# EAGLE design segger_adaptor_v1 (EAGLE 6.5.0)
AUTHOR: Noah Klugman; REV: A; TITLE: JLink to Tag Connect
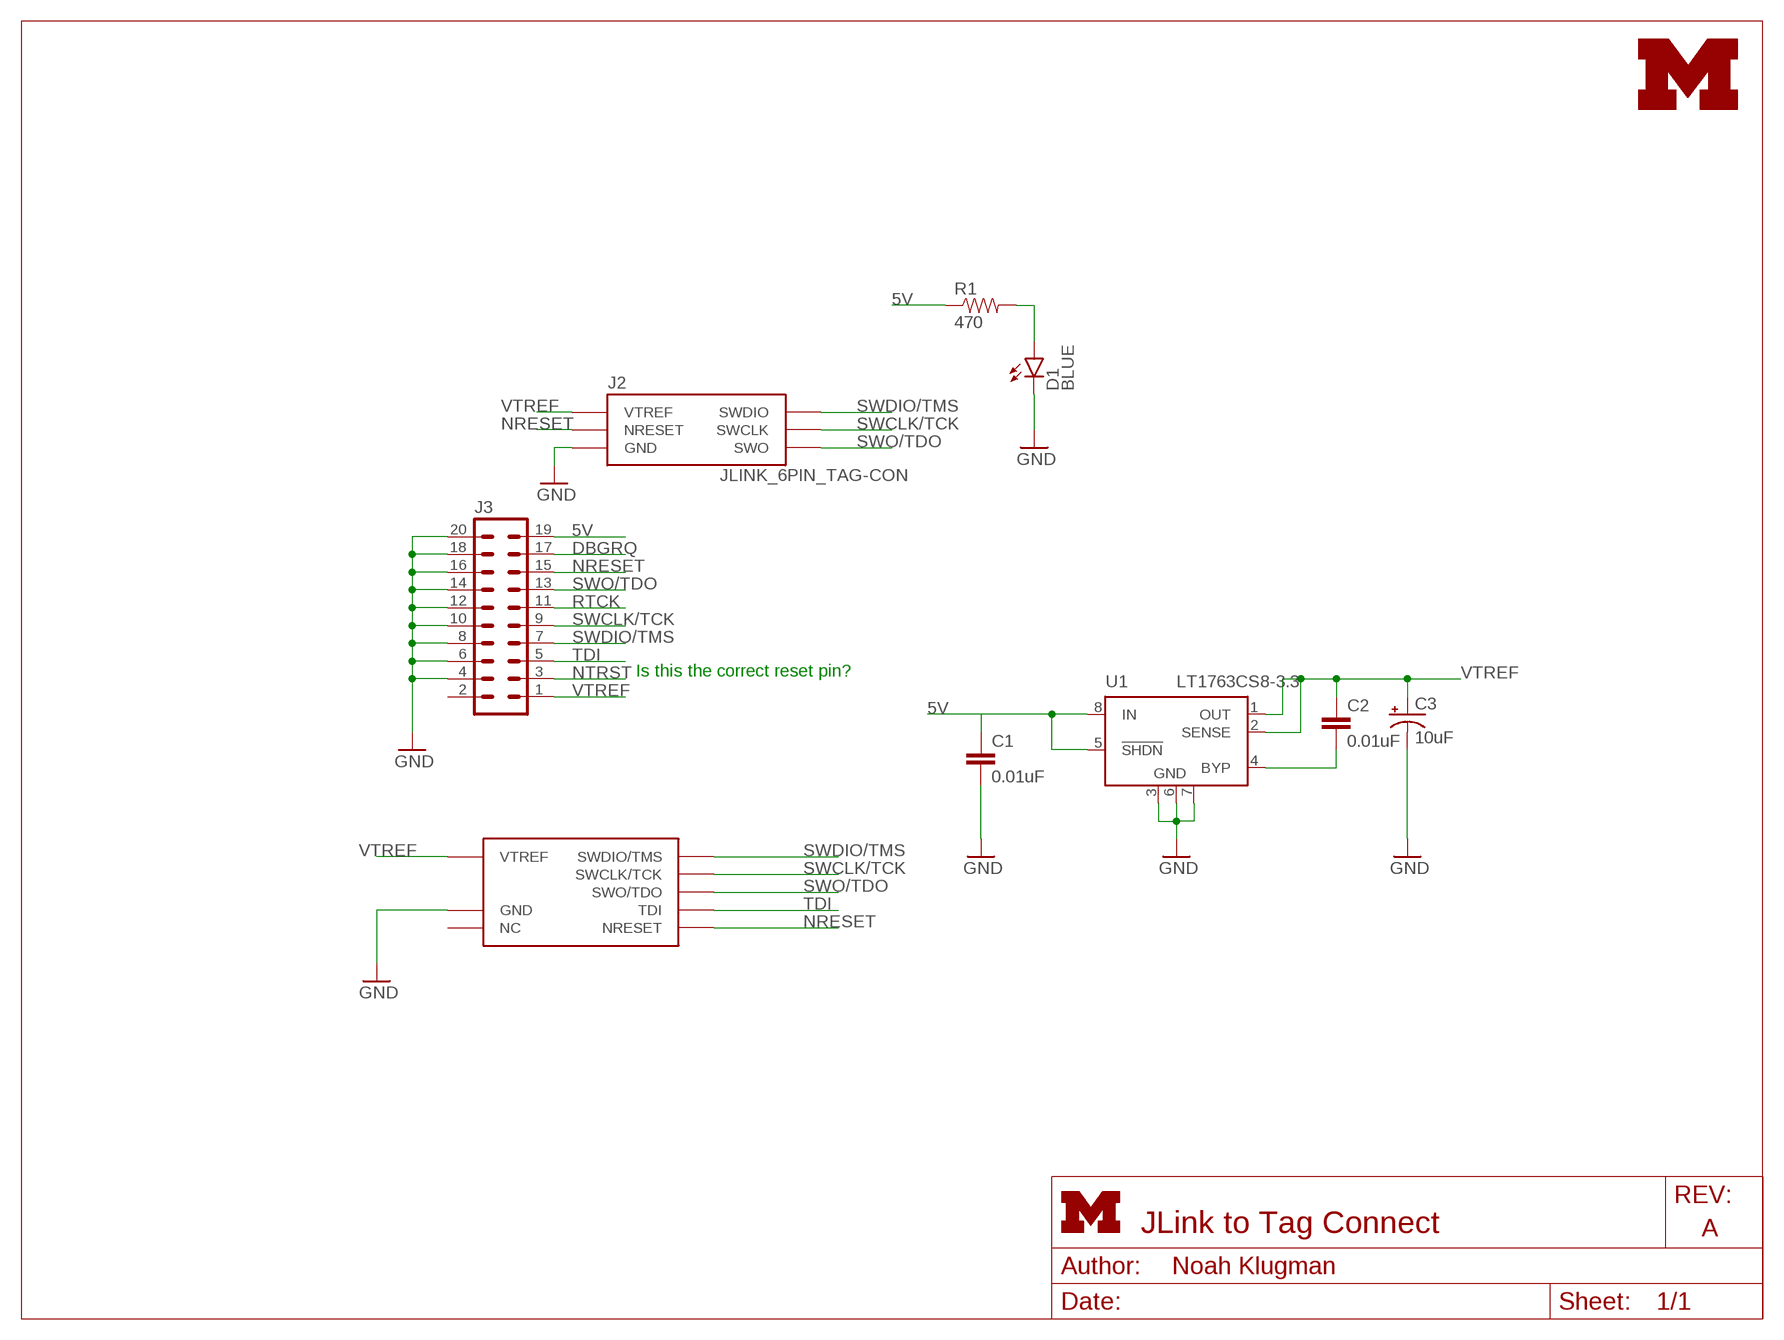
[diagram p0: schematic, sheet 1]
FRAME1 (LETTER_L): HEIGHT: 8.5in; WIDTH: 11in

## Parts
C1  0.01uF  C-EUC0603  [C0603]
C2  0.01uF  C-EUC0603  [C0603]
C3  10uF  CAP_POL1206  [EIA3216]
D1  BLUE  LED-BLUE0603  [LED-0603]
J1  PINHD-2X5/0.050-NO7  [2X5-0.050-NO7]
J2  JLINK_6PIN_TAG-CON  [2X3_MALE_SHROUDED_0.100]
J3  ML20  [ML20]
LOGO1  UMICH_SOLID_SMALL+  [UMICH_SOLID_100MIL]
R1  470  RESISTOR0603-RES  [0603-RES]
U1  LT1763CS8-3.3  [SOIC8]

## Nets
5V: C1.1 J3.19 R1.1 U1.5(!SHDN) U1.8(IN)
DBGRQ: J3.17
GND: C1.2 C3.C(-) D1.C J1.GND@1(GND) J1.GND@2(GND) J2.5(GND) J3.4 J3.6 J3.8 J3.10 J3.12 J3.14 J3.16 J3.18 J3.20 U1.3(GND) U1.6(GND) U1.7(GND)
N$3: D1.A R1.2
N$4: C2.2 U1.4(BYP)
NRESET: J1.NRESET J2.3(NRESET) J3.15
NTRST: J3.3
RTCK: J3.11
SWCLK/TCK: J1.SWCLK/TCK J2.4(SWCLK) J3.9
SWDIO/TMS: J1.SWDIO/TMS J2.2(SWDIO) J3.7
SWO/TDO: J1.SWO/TDO J2.6(SWO) J3.13
TDI: J1.TDI J3.5
VTREF: C2.1 C3.A(+) J1.VTREF J2.1(VTREF) J3.1 U1.1(OUT) U1.2(SENSE)
Unconnected: J1.NC J3.2

## Notes on the sheet
- Is this the correct reset pin?

## Library data of the parts
C1 C2 = resistor:C-EU: CAPACITOR, European symbol; DIGIKEY: 490-1512-1-ND
C3 = SparkFun-Passives:CAP_POL: Capacitor Polarized These are standard SMD and PTH capacitors. Normally 10uF, 47uF, and 100uF in electrolytic and tantalum varieties. Always verify the external diameter of the through hole cap, it varies with capacity, voltage, and manufacturer. The EIA devices should be standard.; DIGIKEY: 399-3684-1-ND
D1 = SparkFun-LED:LED-BLUE: Blue LEDs for production use Various blue LEDs stocked by SparkFun production 0603 - DIO-08575 Rebel - DIO-09553 1206 - DIO-09911; PROD_ID: DIO-08575
J1 = headers:PINHD-2X5/0.050-NO7; DIGIKEY: 609-3712-ND
J2 = headers:JLINK_6PIN_TAG-CON: This is a 6-pin Tag Connect header with the J-Link.; DIGIKEY: 3M15451-ND
J3 = con-ml:ML20: HARTING; DIGIKEY: S9172-ND; OC_FARNELL: unknown; OC_NEWARK: unknown
LOGO1 = logos:UMICH_SOLID
R1 = SparkFun-Passives:RESISTOR: Resistor Basic schematic elements and footprints for 0603, 1206, and PTH resistors.
U1 = linear-technology:LT1763CS8: 500mA, Low Noise, LDO Micropower Regulators Source: http://cds.linear.com/docs/Datasheet/1763ff.pdf; DIGIKEY: LT1763CS8-3.3#TRPBFCT-ND; MPN: LT1763CS8-3.3; OC_FARNELL: 1273617; OC_NEWARK: 57M6055

## Board
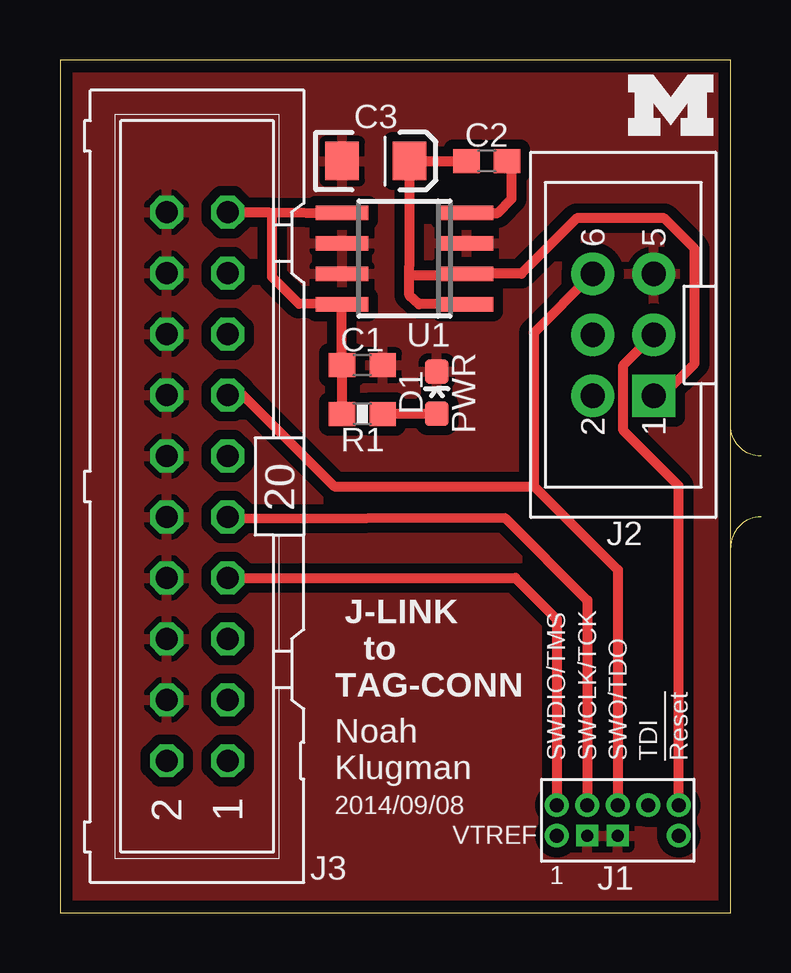
[diagram p1: board, top side]
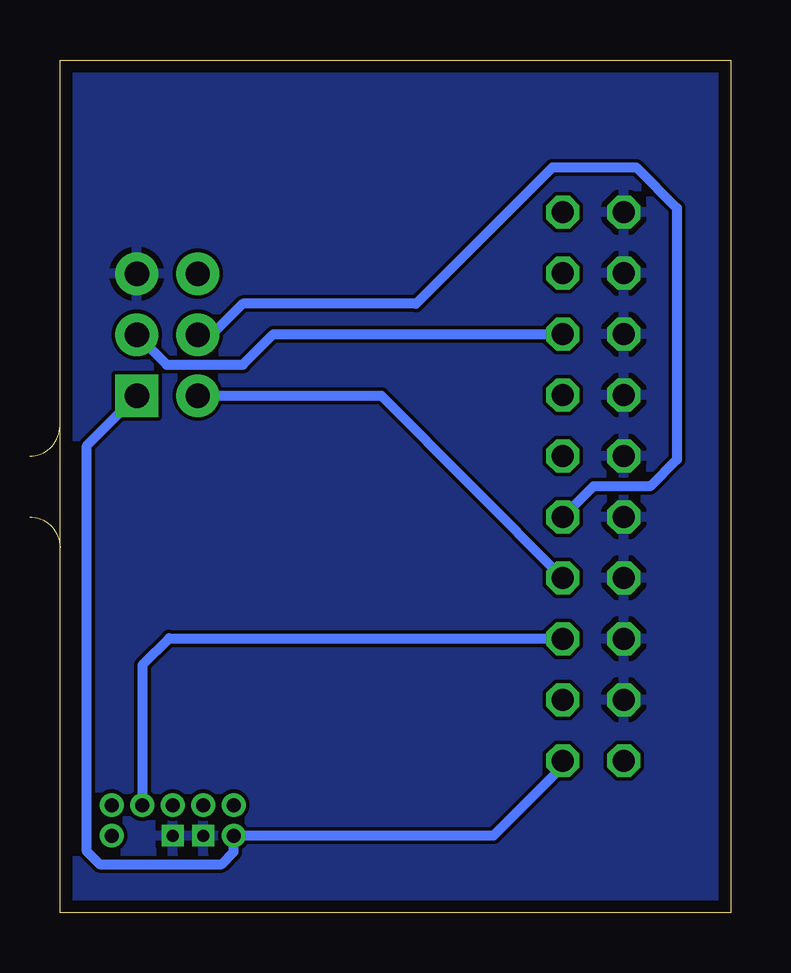
[diagram p2: board, bottom side, seen from below]

Size 27.94 x 35.56 mm. Coordinates in mm from the lower left corner, seen from the top.
Outline: 0,35.56 0,0 27.94,0 27.94,35.56 0,35.56
Copper layers (1*16): Top 0.0178mm / dielectric 59mil / Bottom 0.0178mm
Design rules "sunstone-2lyr_v1.0.0.3": minimum track width 6mil, minimum drill 14mil, track to track 6mil, track to pad 6mil, pad to pad 6mil, via to via 6mil, smd to smd 6mil, copper to edge 20mil, drill to drill 16mil, minimum pad ring 8mil, minimum via ring 8mil, stop-mask expansion 3mil, vias tented up to drill 0mil, thermal gap 10mil
Milling: 7 lines

### Footprints (pad centres in the part's own frame; a part is rotated, then mirrored left to right if it is on the bottom)
C0603 = smd 1.1 x 1: 1 -0.85,0; 2 0.85,0
EIA3216 = smd 1.4 x 1.6: A 1.4,0; C -1.4,0
LED-0603 = smd 1 x 1: A 0,-0.877; C 0,0.877
2X5-0.050-NO7 = drill 0.5 square: GND@1 -2.54,0; GND@2 -1.27,0 | drill 0.584: NC 1.27,0; NRESET 1.27,1.27; SWCLK/TCK -2.54,1.27; SWDIO/TMS -3.81,1.27; SWO/TDO -1.27,1.27; TDI 0,1.27; VTREF -3.81,0
2X3_MALE_SHROUDED_0.100 = drill 1.016 pad 1.778 square: 1 -2.54,-1.27 | drill 1.016 pad 1.778: 2 -2.54,1.27; 3 0,-1.27; 4 0,1.27; 5 2.54,-1.27; 6 2.54,1.27
ML20 = drill 0.914 octagon: 1 -11.43,-1.27; 2 -11.43,1.27; 3 -8.89,-1.27; 4 -8.89,1.27; 5 -6.35,-1.27; 6 -6.35,1.27; 7 -3.81,-1.27; 8 -3.81,1.27; 9 -1.27,-1.27; 10 -1.27,1.27; 11 1.27,-1.27; 12 1.27,1.27; 13 3.81,-1.27; 14 3.81,1.27; 15 6.35,-1.27; 16 6.35,1.27; 17 8.89,-1.27; 18 8.89,1.27; 19 11.43,-1.27; 20 11.43,1.27
0603-RES = smd 1.1 x 1: 1 -0.85,0; 2 0.85,0
SOIC8 = smd 0.6 x 2.2: 1 -1.905,-2.6; 2 -0.635,-2.6; 3 0.635,-2.6; 4 1.905,-2.6; 5 1.905,2.6; 6 0.635,2.6; 7 -0.635,2.6; 8 -1.905,2.6

### Placement (x,y rotation side)
C1  12.6,22.83 0 top
C2  17.78,31.34 0 top
C3  13.16,31.34 0 top
D1  15.7,21.69 0 top
J1  24.51,3.23 0 top
J2  23.47,24.1 90 top
J3  5.71,17.78 90 top
LOGO1  23.67,32.41 0 top
R1  12.6,20.8 0 top
U1  14.35,27.28 90 top

### Tracks (layer width: path | path; a pad name or v marks a point on that pad's centre or on a via)
5V
  Top 0.406: J3.19 8.69,29.21 | 8.69,29.21 U1.5 11.76,29.22 | C1.1 11.75,25.4 U1.8 9.96,25.4 8.84,26.52 8.84,29.06 8.69,29.21 | 11.77,22.84 C1.1 | C1.1 R1.1
GND
  pour Top (isolate 0.406): -2.54,-2.54 30.48,-2.54 30.48,38.1 -2.54,38.1
  pour Bottom: -1.27,36.83 29.21,36.83 29.21,-1.27 -1.27,-1.27
N$3
  Top 0.406: 15.68,20.83 D1.A 13.46,20.82 R1.2
N$4
  Top 0.406: U1.4 18.24,29.18 18.82,29.77 18.82,31.15 C2.2
NRESET
  Top 0.406: J1.NRESET 25.78,17.8 23.47,20.12 23.47,22.84 J2.3
  Bottom 0.406: J2.3 23.5,22.86 20.32,22.86 19.05,24.13 J3.15
SWCLK/TCK
  Top 0.406: 7.19,16.43 J3.9 7.06,16.43 18.54,16.46 21.97,13.03 J1.SWCLK/TCK
  Bottom 0.406: J2.4 21.61,24.11 20.32,25.4 13.11,25.4 7.42,31.09 3.94,31.09 2.23,29.39 2.23,18.9 3.35,17.78 5.71,17.78 J3.9
SWDIO/TMS
  Top 0.406: J3.7 18.97,13.97 20.7,12.24 J1.SWDIO/TMS
  Bottom 0.406: J2.2 14.55,21.57 J3.7
SWO/TDO
  Top 0.406: 19.74,17.8 19.74,24.18 J2.6 | 19.74,17.8 23.24,14.3 J1.SWO/TDO | J3.13 7.62,21.59 11.43,17.78 19.71,17.78 19.74,17.8
TDI
  Bottom 0.406: J3.5 7.01,11.46 23.39,11.46 24.51,10.34 J1.TDI
VTREF
  Top 0.406: U1.1 14.96,25.38 14.55,25.76 14.55,26.67 | 14.55,26.67 14.55,26.99 14.56,27 C3.A C2.1 | 14.55,26.67 14.63,26.59 16.93,26.59 U1.2 19.23,26.64 21.54,28.96 25.17,28.96 26.44,27.69 26.44,22.91 25.09,21.57 J2.1
  Bottom 0.406: J3.1 6.99,6.12 9.88,3.23 J1.VTREF 20.7,2.54 21.21,2.03 26.29,2.03 26.82,2.56 26.82,19.48 J2.1

### Text on the board
tPlace: PWR | J-LINK / to / TAG-CONN | Noah / Klugman | SWDIO/TMS | SWCLK/TCK | SWO/TDO | TDI | !Reset | 2014/09/08 | VTREF